# Altium schematic sheet Connectors.SchDoc
size A; SheetNumber: 10
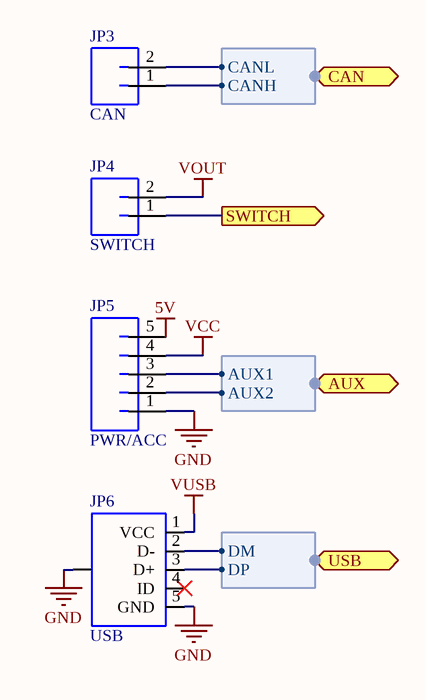
[diagram p0: Connectors.SchDoc]

## Parts
JP3  CAN  [JST-PH-2-PTH-VERT]
JP4  SWITCH  [JST-PH-2-PTH-VERT]
JP5  PWR/ACC  [JST-PH-5-PTH-VERT]
JP6  USB  [USB-MICROB]

## Ports
AUX (harness Auxiliary Outputs), CAN (harness CAN Output), SWITCH (out), USB (harness USB)

## Harnesses
USB: DM, DP
Auxiliary Outputs: AUX1, AUX2
CAN Output: CANL, CANH

## Nets
5V: JP5.5
GND: JP5.1 JP6.5(GND) JP6.6(SHIELD)
VCC: JP5.4
VOUT: JP4.2
VUSB: JP6.1(VCC)
SWITCH: JP4.1 ; port SWITCH
NetJP3_1: JP3.1 ; port CAN.CANH
NetJP3_2: JP3.2 ; port CAN.CANL
NetJP5_2: JP5.2 ; port AUX.AUX2
NetJP5_3: JP5.3 ; port AUX.AUX1
NetJP6_2: JP6.2(D-) ; port USB.DM
NetJP6_3: JP6.3(D+) ; port USB.DP

Not connected (* = marked no-connect by the designer): JP6 4(ID)*

## Library data of the parts
JP3 JP4 = JST_PH_2_VERT: Manufacturer: JST Sales America, Inc.; PartNumber: B2B-PH-K-S(LF)(SN); Mounting Technology: Through Hole; PackageReference: JST-PH
JP5 = JST_PH_5_VERT: Manufacturer: JST Sales America, Inc.; PartNumber: B5B-PH-K-S(LF)(SN); PackageReference: JST-PH; Mounting Technology: Through Hole
JP6 = USB_MICROB_SMT: pin to pad: 1>VBUS 2>D- 3>D+ 4>ID 5>GND 6>MT1+P$1+P$2+MT2; PartNumber: 10118192-0001LF; Manufacturer: Amphenol FCI; Mounting Technology: Surface Mount; PackageReference: USB - Micro B